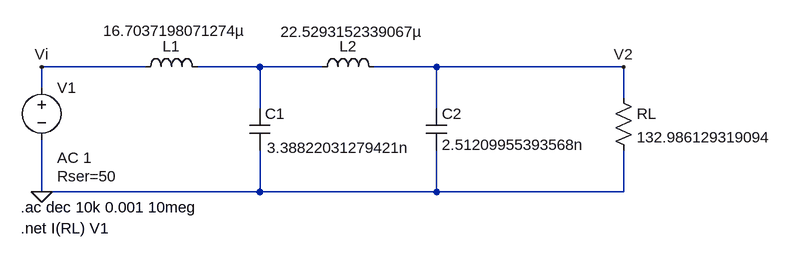
[diagram p0: schematic Desnormalizado.asc]
Desnormalizado.asc, the LTspice schematic file:
Version 4
SHEET 1 1340 680
WIRE 128 128 -32 128
WIRE 304 128 208 128
WIRE 400 128 304 128
WIRE 576 128 480 128
WIRE 864 128 576 128
WIRE -32 160 -32 128
WIRE 864 176 864 128
WIRE 304 192 304 128
WIRE 576 192 576 128
WIRE -32 320 -32 240
WIRE 304 320 304 256
WIRE 304 320 -32 320
WIRE 576 320 576 256
WIRE 576 320 304 320
WIRE 864 320 864 256
WIRE 864 320 576 320
FLAG -32 320 0
FLAG 864 128 V2
FLAG -32 128 Vi
SYMBOL voltage -32 144 R0
WINDOW 123 24 124 Left 2
WINDOW 39 24 152 Left 2
SYMATTR Value2 AC 1
SYMATTR SpiceLine Rser=50
SYMATTR InstName V1
SYMATTR Value ""
SYMBOL ind 112 144 R270
WINDOW 0 32 56 VTop 2
WINDOW 3 87 62 VBottom 2
SYMATTR InstName L1
SYMATTR Value 16.7037198071274µ
SYMBOL ind 384 144 R270
WINDOW 0 32 56 VTop 2
WINDOW 3 86 63 VBottom 2
SYMATTR InstName L2
SYMATTR Value 22.5293152339067µ
SYMBOL cap 288 192 R0
WINDOW 3 27 60 Left 2
SYMATTR Value 3.38822031279421n
SYMATTR InstName C1
SYMBOL cap 560 192 R0
SYMATTR InstName C2
SYMATTR Value 2.51209955393568n
SYMBOL res 848 160 R0
SYMATTR InstName RL
SYMATTR Value 132.986129319094
TEXT -64 344 Left 2 !.ac dec 10k 0.001 10meg
TEXT -64 376 Left 2 !.net I(RL) V1

The netlist it stands for:
* Desnormalizado.asc
V1 Vi 0 AC 1 Rser=50
L1 Vi N001 16.7037198071274µ
L2 N001 V2 22.5293152339067µ
C1 N001 0 3.38822031279421n
C2 V2 0 2.51209955393568n
RL V2 0 132.986129319094
.ac dec 10k 0.001 10meg
.net I(RL) V1
.backanno
.end